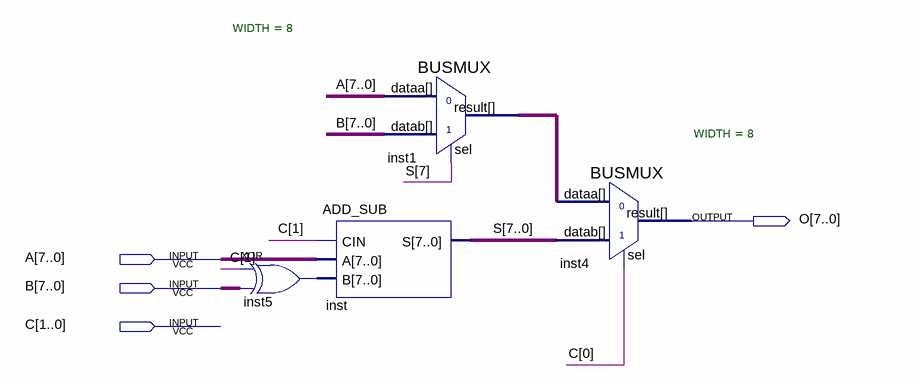
[diagram p0: schematic sheet]
// Quartus schematic ADD_MAX_SUB.bdf as structural Verilog: 4 symbols, 4 pins
module ADD_MAX_SUB (
  input  [7:0] A,
  input  [7:0] B,
  input  [1:0] C,
  output [7:0] O
);

  wire [7:0] inst1_result, inst5_out, S;

  assign inst5_out = {8{C[1]}} ^ B;  // XOR inst5, 8 bits wide
  ADD_SUB inst (.CIN(C[1]), .A(A), .B(inst5_out), .S(S));
  BUSMUX #(.WIDTH(8)) inst1 (.datab(B), .sel(S[7]), .dataa(A), .result(inst1_result));
  BUSMUX #(.WIDTH(8)) inst4 (.datab(S), .sel(C[0]), .dataa(inst1_result), .result(O));
endmodule
